# EAGLE design Awesome-Shield-0.5 (EAGLE 7.2.0)
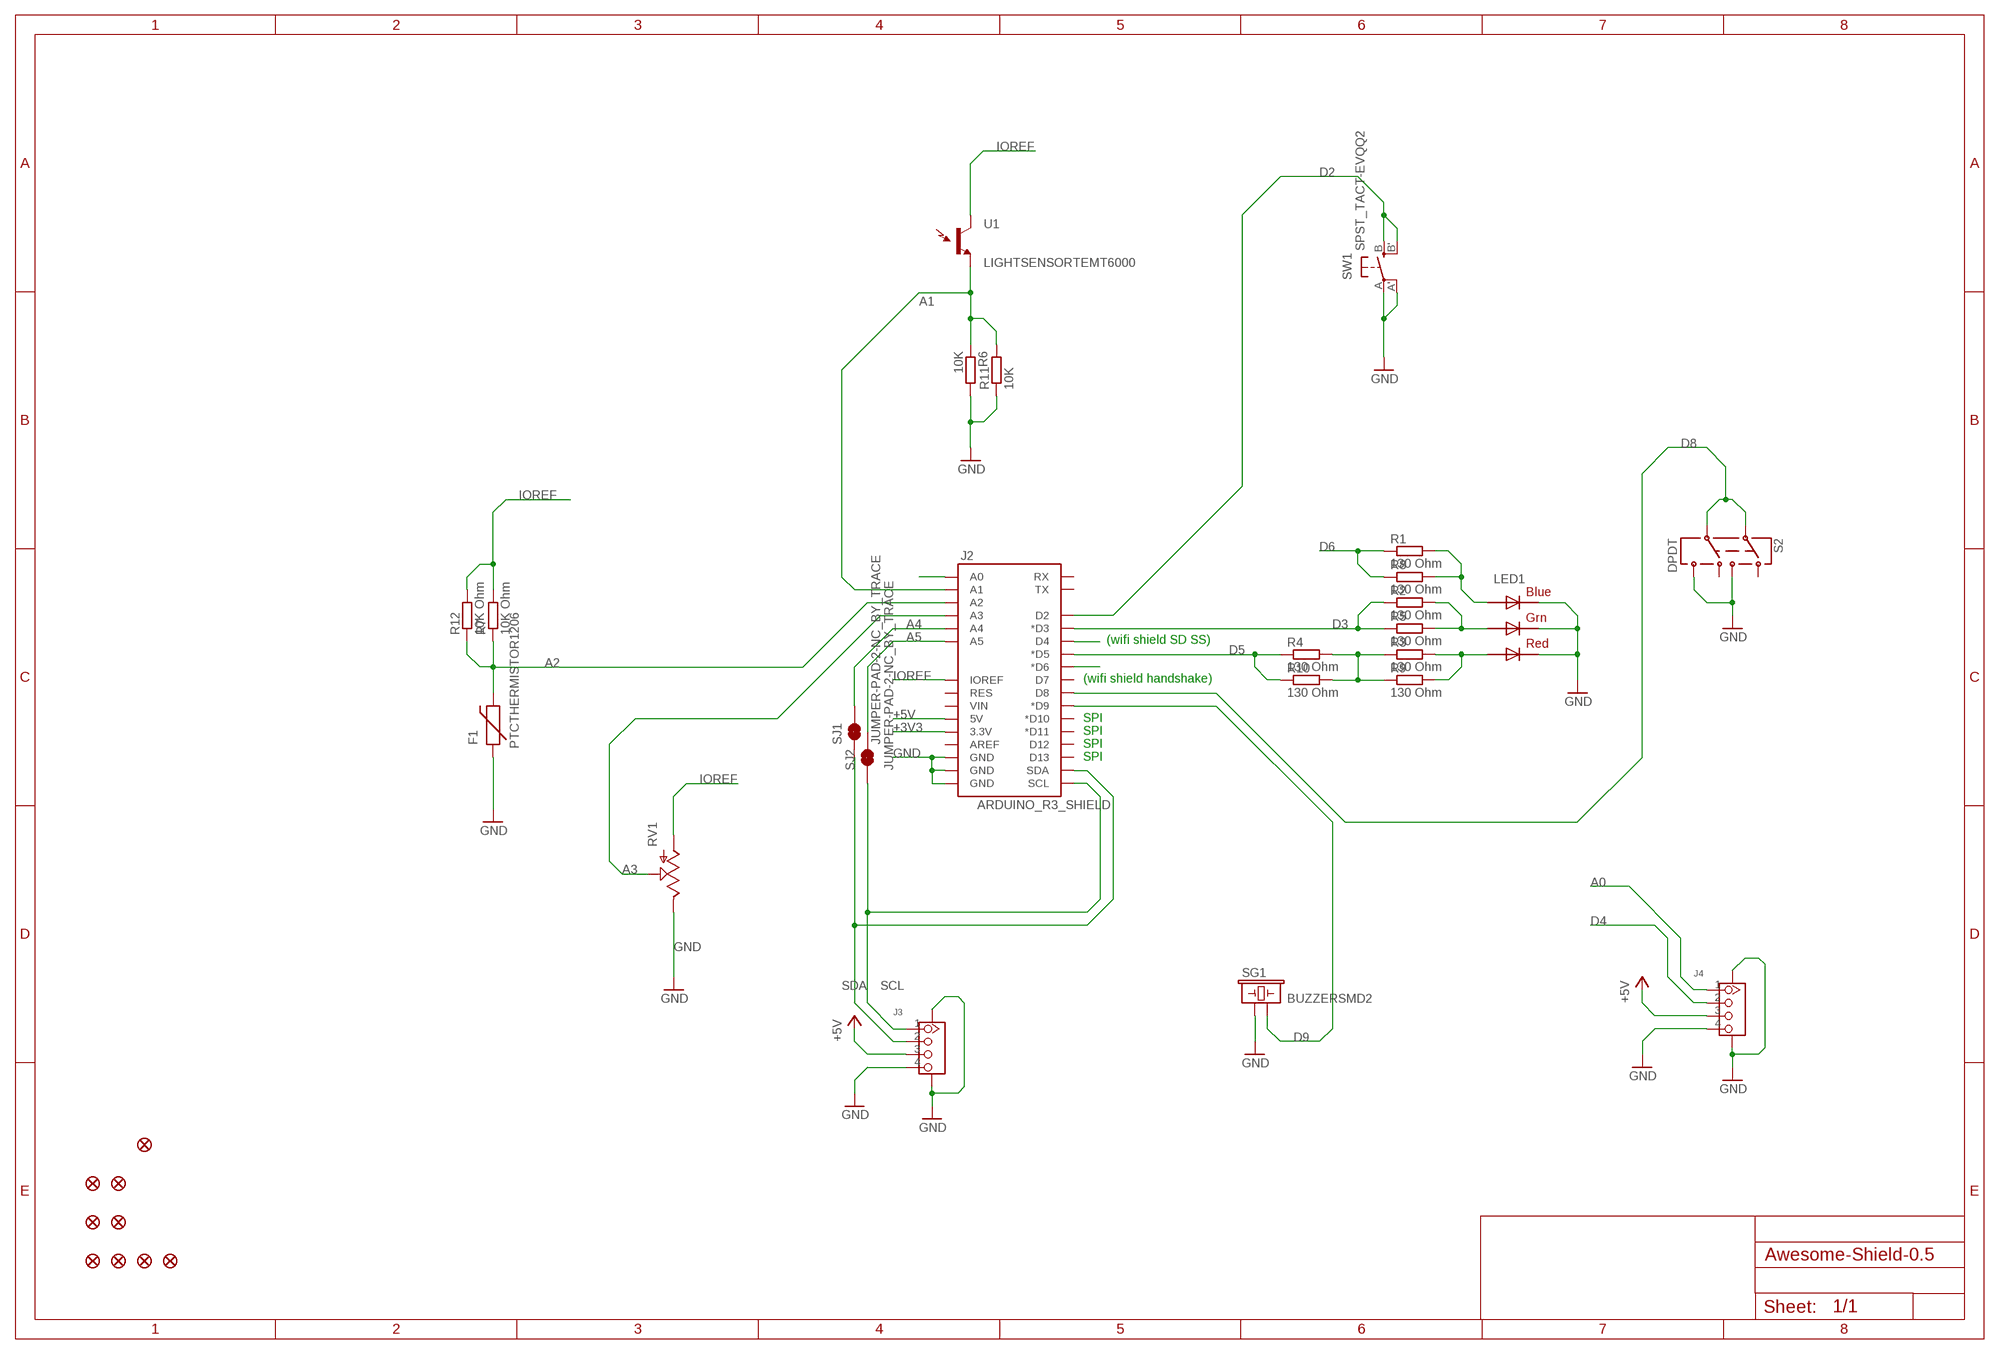
[diagram p0: schematic, sheet 1]

## Parts
F1  PTCTHERMISTOR1206  [PTC-1206]
FID1  FIDUCIAL1X2  [FIDUCIAL-1X2]
FID2  FIDUCIAL1X2  [FIDUCIAL-1X2]
FID3  FIDUCIAL1X2  [FIDUCIAL-1X2]
FID4  FIDUCIAL1X2  [FIDUCIAL-1X2]
FID5  FIDUCIALUFIDUCIAL  [MICRO-FIDUCIAL]
FID6  FIDUCIALUFIDUCIAL  [MICRO-FIDUCIAL]
FID9  FIDUCIALUFIDUCIAL  [MICRO-FIDUCIAL]
FID10  FIDUCIALUFIDUCIAL  [MICRO-FIDUCIAL]
FID15  FIDUCIALUFIDUCIAL  [MICRO-FIDUCIAL]
J2  ARDUINO_R3_SHIELD  [UNO_R3_SHIELD]
J3  GROVE-CONNECTOR-SMD(4+2P-2.0)  [HW4-SMD-2.0]
J4  GROVE-CONNECTOR-SMD(4+2P-2.0)  [HW4-SMD-2.0]
LED1  RGBLED5050  [RGBLED5050]
R1  130 Ohm  R-EU_R1206  [R1206]
R2  130 Ohm  R-EU_R1206  [R1206]
R3  130 Ohm  R-EU_R1206  [R1206]
R4  130 Ohm  R-EU_R1206  [R1206]
R5  130 Ohm  R-EU_R0603  [R0603]
R6  10K  R-EU_R1206  [R1206]
R7  10K Ohm  R-EU_R1206  [R1206]
R8  130 Ohm  R-EU_R0603  [R0603]
R9  130 Ohm  R-EU_R0603  [R0603]
R10  130 Ohm  R-EU_R0603  [R0603]
R11  10K  R-EU_R0603  [R0603]
R12  10K Ohm  R-EU_R0603  [R0603]
RV1  POT  [ALPS_POT]
S2  DPDT  SWITCH-DPDTAYZ0202  [AYZ0202]
SG1  BUZZERSMD2  [BUZZER-CCV]
SJ1  JUMPER-PAD-2-NC_BY_TRACE  [PAD-JUMPER-2-NC_BY_TRACE_YES_SILK]
SJ2  JUMPER-PAD-2-NC_BY_TRACE  [PAD-JUMPER-2-NC_BY_TRACE_YES_SILK]
SW1  SPST_TACT-EVQQ2  [EVQ-Q2]
U1  LIGHTSENSORTEMT6000  [TEMT6000-SEN]

## Nets
+3V3: J2.3.3V
+5V: J2.5V J3.3 J4.3
A0: J2.A0 J4.1
A1: J2.A1 R6.1 R11.2 U1.EMITTER(E1)
A2: F1.2 J2.A2 R7.1 R12.1
A3: J2.A3 RV1.P$2(S)
A4: J2.A4 SJ1.2
A5: J2.A5 SJ2.2
D2: J2.D2 SW1.B'(S1) SW1.B(S)
D3: J2.D3(*D3) R2.1 R5.1
D4: J2.D4 J4.2
D5: J2.D5(*D5) R4.1 R10.1
D6: J2.D6(*D6) R1.1 R8.1
D8: J2.D8 S2.2 S2.5
D9: J2.D9(*D9) SG1.-
GND: F1.1 J2.GND@0(GND) J2.GND@1(GND) J2.GND@2(GND) J3.4 J3.SS1 J3.SS2 J4.4 J4.SS1 J4.SS2 LED1.4(BLUE_C) LED1.5(RED_C) LED1.6(GREEN_C) R6.2 R11.1 RV1.P$1(E) S2.3 S2.6 SG1.+ SW1.A'(P1) SW1.A(P)
IOREF: J2.IOREF R7.2 R12.2 RV1.P$3(A) U1.COLLECTOR(C1)
N$2: R3.1 R4.2 R9.1 R10.2
N$3: LED1.2(RED_A) R3.2 R9.2
N$8: LED1.3(BLUE_A) R1.2 R8.2
N$9: LED1.1(GREEN_A) R2.2 R5.2
SCL: J2.SCL J3.1 SJ2.1
SDA: J2.SDA J3.2 SJ1.1
Unconnected: J2.AREF J2.D7 J2.D10(*D10) J2.D11(*D11) J2.D12 J2.D13 J2.RES J2.RX J2.TX J2.VIN S2.1 S2.4

## Notes on the sheet
- (wifi shield SD SS)
- (wifi shield handshake)
- SPI
- SPI
- SPI
- SPI

## Library data of the parts
F1 = SparkFun-PowerIC:PTC: Resettable Fuse PTC Resettable Fuse. Spark Fun Electronics SKU : COM-08357; PROD_ID: RES-08585
FID1-FID6 FID9 FID10 FID15 = SparkFun-Aesthetics:FIDUCIAL: Fiducial Alignment Points Various fiducial points for machine vision alignment.
J2 = SparkFun-Boards:ARDUINO_R3_SHIELD: Shield form compatible with the Arduino Uno R3.
J3 J4 = Seeed-OPL-Connector:GROVE-CONNECTOR-SMD(4+2P-2.0): 320110030
LED1 = adafruit:RGBLED: For 5050 RGB LEDs, the order of the LEDs may vary from one manufacturer to another!
R1-R12 = rcl:R-EU_: RESISTOR, European symbol
RV1 = SparkFun-Electromechanical:POT; PROD_ID: RES-09177
S2 = SparkFun-Electromechanical:SWITCH-DPDT: DPDT Version of the COM-00597; PROD_ID: SWCH-08179
SG1 = SparkFun-Electromechanical:BUZZER: Buzzer 12mm Spark Fun Electronics SKU : Comp-Buzzer
SJ1 SJ2 = SparkFun-Passives:JUMPER-PAD-2-NC_BY_TRACE
SW1 = adafruit:SPST_TACT: SMT 6mm switch, EVQQ2 series http://www.ladyada.net/library/eagle
U1 = SparkFun-Sensors:LIGHTSENSOR: Ambient Light Sensor Simple light detection sensor. Output varies with light intensity input. Spark Fun Electronics SKU : COM-08348

## Net classes
0 default: width 0.203 mm, drill 0.305 mm, clearance 0.152 mm

## Board
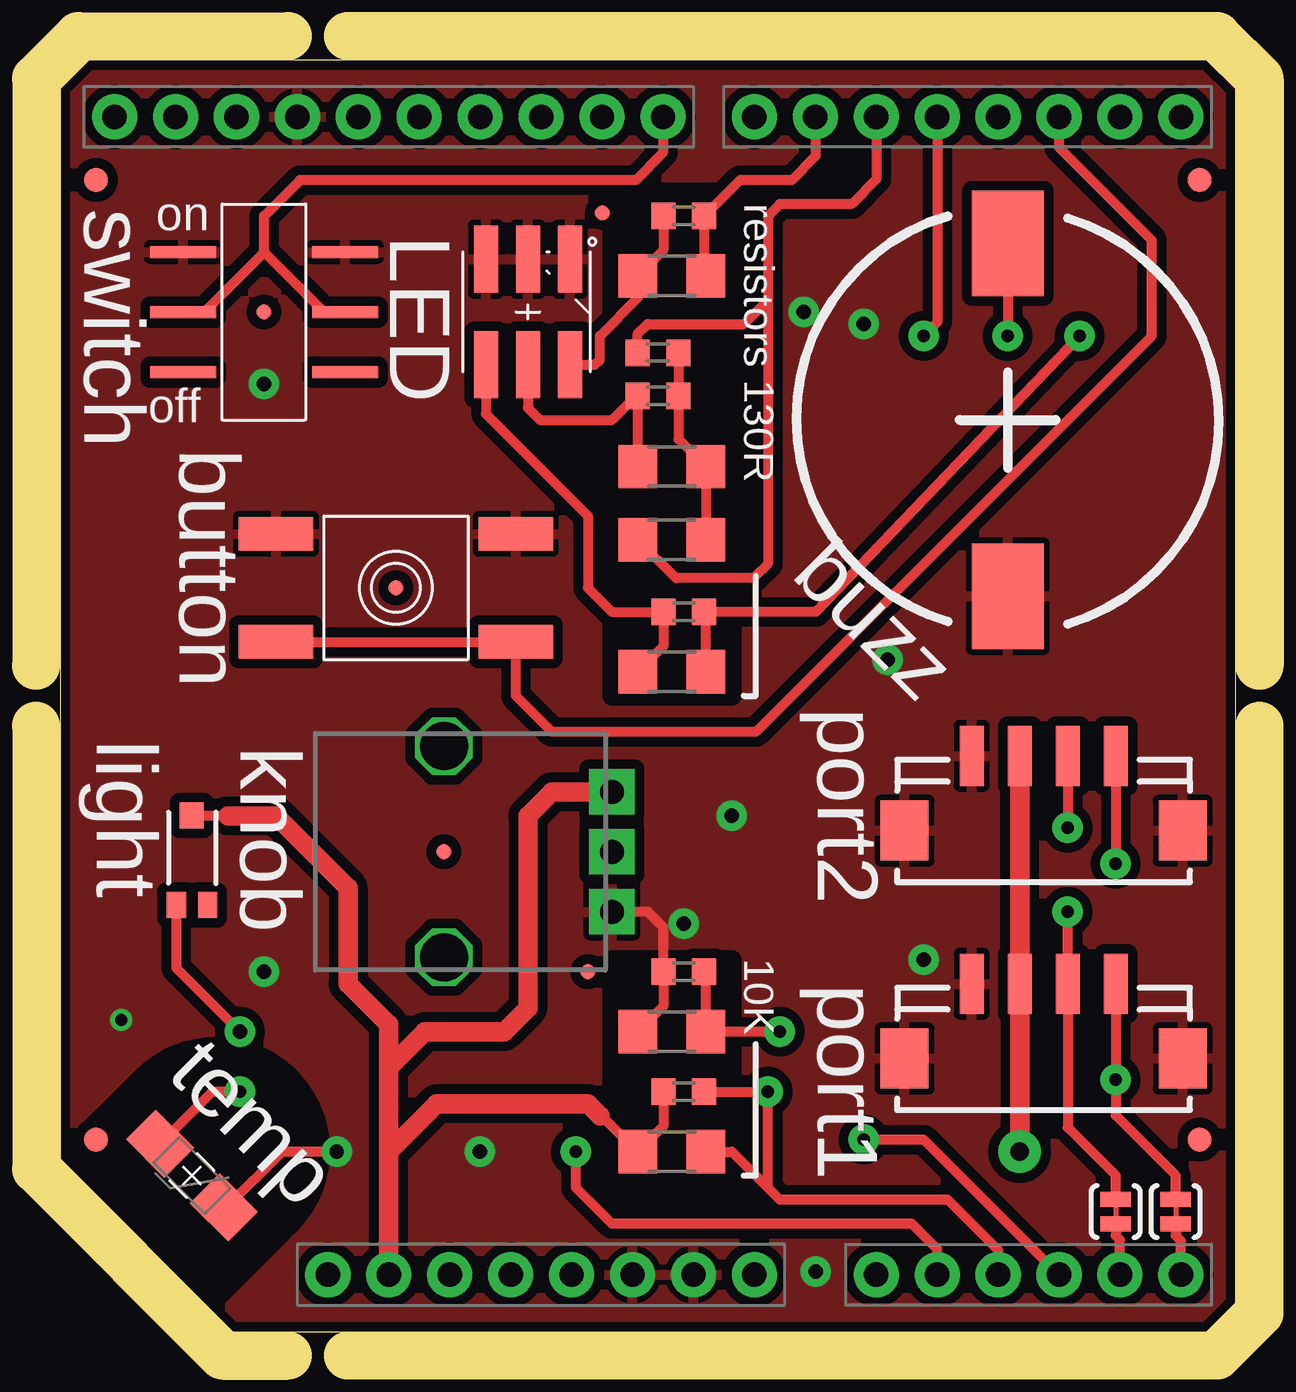
[diagram p1: board, top side]
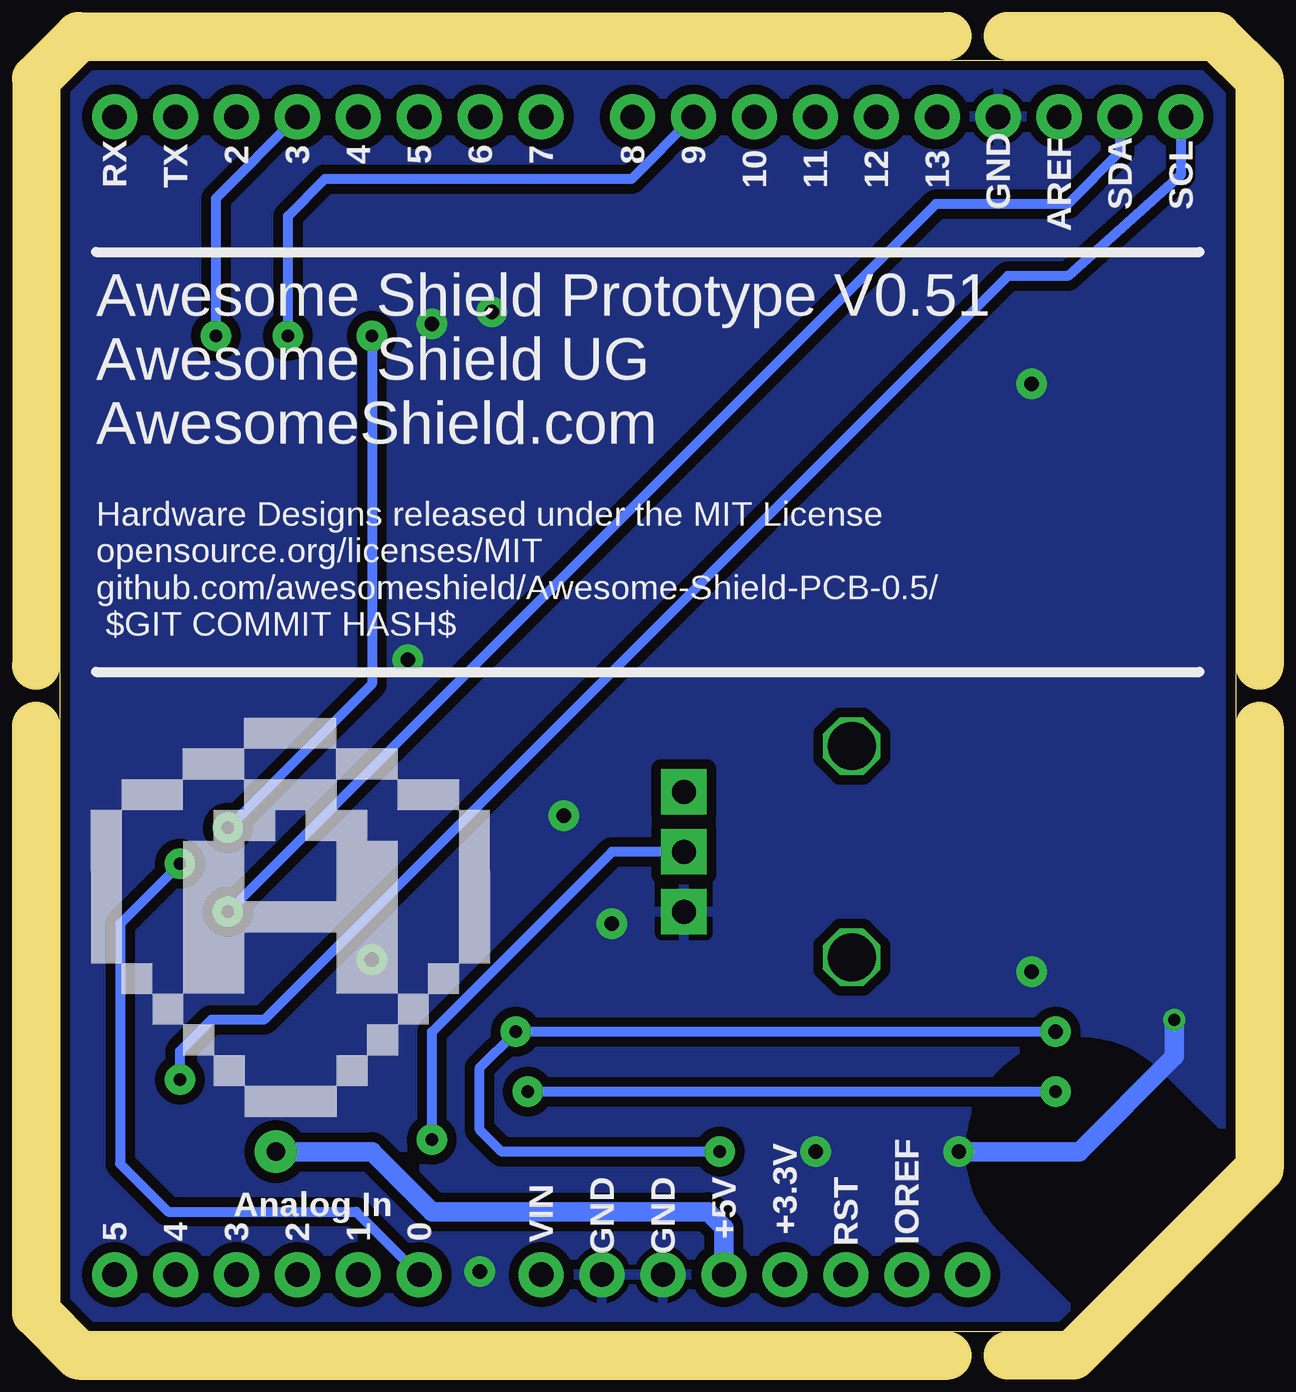
[diagram p2: board, bottom side, seen from below]

Size 49 x 53 mm. Coordinates in mm from the lower left corner, seen from the top.
Outline: 1.2,53 0,51.8 0,7.2 7.2,0 47.8,0 49,1.2 49,51.8 47.8,53 1.2,53
Copper layers (1*16): Top 0.035mm / dielectric 1.5mm / Bottom 0.035mm
Design rules "hakaZwilling *": minimum track width 0.2mm, minimum drill 0.5mm, track to track 0.2mm, track to pad 0.2mm, pad to pad 0.15mm, via to via 0.2mm, smd to smd 0mil, copper to edge 0.2mm, drill to drill 0.2mm, minimum pad ring 0.2mm, minimum via ring 0.2mm, stop-mask expansion 0.1mm, vias tented up to drill 0.6mm, thermal gap 10mil
tRestrict: area 23,26.5 to 28,47.5; area 23,6.5 to 28,15.5; area 0.3,1.3 to 10.6,11.7
bRestrict: area 0.3,1.3 to 10.6,11.7
Milling: 12 lines

### Footprints (pad centres in the part's own frame; a part is rotated, then mirrored left to right if it is on the bottom)
PTC-1206 = smd 2.25 x 1.75: 1 -1.875,0; 2 1.875,0
FIDUCIAL-1X2 = smd 1 x 1: 1 0,0
MICRO-FIDUCIAL = smd 0.635 x 0.635: 1 0,0
UNO_R3_SHIELD = drill 1.016 pad 1.88: 3.3V 50.8,26.67; 5V 50.8,29.21; A0 50.8,41.91; A1 50.8,44.45; A2 50.8,46.99; A3 50.8,49.53; A4 50.8,52.07; A5 50.8,54.61; AREF 2.54,15.24; D2 2.54,49.53; D3 2.54,46.99; D4 2.54,44.45; D5 2.54,41.91; D6 2.54,39.37; D7 2.54,36.83; D8 2.54,33.02; D9 2.54,30.48; D10 2.54,27.94; D11 2.54,25.4; D12 2.54,22.86; D13 2.54,20.32; GND@0 50.8,31.75; GND@1 50.8,34.29; GND@2 2.54,17.78; IOREF 50.8,21.59; NC 50.8,19.05; RES 50.8,24.13; RX 2.54,54.61; SCL 2.54,10.16; SDA 2.54,12.7; TX 2.54,52.07; VIN 50.8,36.83
HW4-SMD-2.0 = smd 1 x 2.5: 1 -3,0; 2 -1,0; 3 1,0; 4 3,0 | smd 2 x 2.5: SS1 -5.8,3.123; SS2 5.8,3.123
RGBLED5050 = smd 2.8 x 1: 1 -2.2,1.75; 2 -2.2,0; 3 -2.2,-1.75; 4 2.2,-1.75; 5 2.2,0; 6 2.2,1.75
R1206 = smd 1.6 x 1.803: 1 -1.422,0; 2 1.422,0
R0603 = smd 1 x 1.1: 1 -0.85,0; 2 0.85,0
ALPS_POT = drill 1 pad 1.88 square: P$1 7,-2.5; P$2 7,0; P$3 7,2.5 | drill 2 octagon: P$4 0,-4.4; P$5 0,4.4
AYZ0202 = smd 0.5 x 2.75: 1 -2.5,3.375; 2 0,3.375; 3 2.5,3.375; 4 -2.5,-3.375; 5 0,-3.375; 6 2.5,-3.375
BUZZER-CCV = smd 4.4 x 3: + 7.35,0; - -7.35,0
PAD-JUMPER-2-NC_BY_TRACE_YES_SILK = smd 0.635 x 1.27: 1 -0.508,0; 2 0.508,0
EVQ-Q2 = smd 3.1 x 1.4: A -5,-2.25; A' 5,-2.25; B -5,2.25; B' 5,2.25
TEMT6000-SEN = smd 1.1 x 0.8: BASE -1.87,-0.65; EMITTER -1.87,0.65 | smd 1.1 x 1: COLLECTOR 1.86,0.01

### Placement (x,y rotation side)
F1  5.5,6.5 135 top
FID1  1.5,8 0 top
FID2  47.5,48 0 top
FID3  47.5,8 0 top
FID4  1.5,48 0 top
FID5  14,31 0 top
FID6  8.5,42.5 0 top
FID9  22.6,46.63 0 top
FID10  22,15 0 top
FID15  16,20 0 top
J2  -7.89,53.17 270 top
J3  41,14.5 180 top
J4  41,24 180 top
LED1  19.5,42.5 90 top
R1  25.5,44 180 top
R2  25.5,27.5 180 top
R3  25.5,36.05 180 top
R4  25.5,33 0 top
R5  26,30 180 top
R6  25.5,12.5 180 top
R7  25.5,7.5 180 top
R8  26,46.5 180 top
R9  24.93,39 180 top
R10  24.93,40.8 0 top
R11  26,15 0 top
R12  26,10 180 top
RV1  16,20 0 top
S2  8.5,42.5 90 top
SG1  39.5,38 270 top
SJ1  44,5 270 top
SJ2  46.5,5 270 top
SW1  14,31 180 top
U1  5.5,19.65 90 top

### Tracks (layer width: path | path; a pad name or v marks a point on that pad's centre or on a via)
+5V  (via drill 0.76 pad 1.78)
  Top 0.813: J4.3 J3.3 v40,7.5
  Bottom 0.813: v40,7.5 36,7.5 33.5,5 22,5 21.33,4.32 J2.5V
A0  (via drill 0.51 pad 1.27)
  Top 0.406: J4.1 v44,19.5
  Bottom 0.406: v44,19.5 46.5,17 46.5,7 44.5,5 36.66,5 J2.A0
A1  (via drill 0.51 pad 1.27, 0.6 pad 1.27)
  Top 0.406: v21.5,7.5 21.5,6 23,4.5 35.5,4.5 36.56,3.43 J2.A1 | v7.5,12.5 4.85,15.15 U1.EMITTER | v30,12.5 R6.1 26.92,14.93 R11.2
  Bottom 0.406: v7.5,12.5 v30,12.5 31.51,10.99 31.51,8.42 30.59,7.5 v21.5,7.5
A2  (via drill 0.51 pad 1.27)
  Top 0.406: R7.1 28,7.5 29.5,6 | v7.5,10 6.35,10 F1.2 | 29.5,6 30,5.5 37,5.5 39.11,3.39 J2.A2 | 29.5,6 v29.5,10 R12.1
  Bottom 0.406: v7.5,10 v29.5,10
A3  (via drill 0.51 pad 1.27)
  Top 0.406: J2.A3 36,8 v33.5,8
  Bottom 0.406: RV1.P$2 26,20 33.5,12.5 v33.5,8
A4
  Top 0.406: SJ1.2 44,4 44.19,3.82 J2.A4
A5
  Top 0.406: SJ2.2 46.5,4 46.72,3.77 J2.A5
D2
  Top 0.406: SW1.B' SW1.B 19,26.5 20.5,25 29,25 45.5,41.5 45.5,45.5 41.64,49.36 J2.D2
D3  (via drill 0.51 pad 1.27)
  Top 0.406: 26.9,30.01 R5.1 | R2.1 26.92,29.93 R5.1 | v42.5,41.5 31.5,30 R5.1
  Bottom 0.406: v42.5,41.5 42.5,47.23 J2.D3
D4  (via drill 0.51 pad 1.27)
  Top 0.406: J4.2 v42,21 | J2.D4 36.56,42.06 v36,41.5
  Bottom 0.406: v42,21 36,27 v36,41.5
D5
  Top 0.406: 29.5,43 29.5,46.5 30,47 33,47 34.03,48.03 J2.D5 | 29.5,43 29.5,32 28.9,31.4 25.68,31.4 R4.1 | R10.1 24.08,41.58 24.5,42 28.5,42 29.5,43
D6
  Top 0.406: R1.1 26.85,44.07 R8.1 28.35,48 30.5,48 31.48,48.98 J2.D6
D8
  Top 0.406: S2.5 11,42.5 8.5,45 | 8.5,45 8.5,46.5 10,48 24,48 25.13,49.14 J2.D8 | 8.5,45 6,42.5 S2.2
D9  (via drill 0.51 pad 1.27)
  Top 0.406: SG1.- v39.5,41.5
  Bottom 0.406: J2.D9 25.19,48.04 37.96,48.04 39.5,46.5 v39.5,41.5
GND  (via drill 0.51, 0.6 pad 1.27)
  Top 0.406: R6.2 25.15,13.57 R11.1 25.15,16.85 24.5,17.5 RV1.P$1 | F1.1 6.93,5.17 9.26,7.5 v11.53,7.5
  Bottom 0.813: v11.53,7.5 6.52,7.5 2.55,11.46 v2.55,12.99
  other vias: 33.5,42 34.5,28 36,15.5 31.5,2.5 8.5,15 31,42.5 8.5,39.5 17.5,7.5 28,21.5 26,17
  pour Top (isolate 0.406): 47.8,53.1 1.2,53 0,51.8 -0.1,7.3 7.2,0 47.8,0 49,1.2 49.06,4.9 49.06,37.9 49,40.5 49,51.9
  pour Bottom (isolate 0.406): 1.2,53 0,51.8 0,7.2 7.2,0 47.8,0 49,1.2 48.96,4.18 49.06,36.88 49,40.5 49,51.9 47.8,53
IOREF
  Top 0.406: R7.2 24.1,7.48 | R7.2 24,7.5 | R12.2 25.15,8.57 R7.2 | 7,21.5 U1.COLLECTOR | 22.5,9 22.58,9 R7.2
  Top 0.813: J2.IOREF 13.7,7.5 | 13.7,7.5 13.7,11 | 13.7,11 13.7,12.8 12,14.5 12,18.5 9,21.5 7,21.5 | 13.7,7.5 15.7,9.5 22,9.5 22.5,9 | RV1.P$3 20.5,22.5 19.5,21.5 19.5,13.5 18.5,12.5 15.2,12.5 13.7,11
N$2
  Top 0.406: R10.2 R9.1 25.78,37.19 R3.1 R4.2
N$3
  Top 0.406: R3.2 R9.2 24,39 23,38 20,38 19.5,38.5 LED1.2
N$8
  Top 0.406: R8.2 25.15,45.07 R1.2 24.08,43.08 22.5,41.5 22.5,40.5 22.3,40.3 LED1.3
N$9
  Top 0.406: R2.2 25.15,28.57 R5.2 23,30 22,31 22,34 17.75,38.25 LED1.1
SCL  (via drill 0.51 pad 1.27)
  Top 0.406: J3.1 v44,10.5 44,9.01 46.5,6.51 SJ2.1
  Bottom 0.406: v44,10.5 44,11.7 42.7,13 40.5,13 9.5,44 7,44 2.27,48.22 J2.SCL
SDA  (via drill 0.51 pad 1.27)
  Top 0.406: v42,17.5 J3.2 42,8.51 44,6.51 SJ1.1
  Bottom 0.406: J2.SDA 4.81,49.19 7,47 12.5,47 v42,17.5

### Text on the board
tPlace: switch | resistors 130R | on | LED | off | button | buzz | port2 | light | knob | 10K | port1 | temp
bPlace: Awesome Shield Prototype V0.51 / Awesome Shield UG / AwesomeShield.com | Hardware Designs released under the MIT License / opensource.org/licenses/MIT / github.com/awesomeshield/Awesome-Shield-PCB-0.5/ / $GIT COMMIT HASH$